# EAGLE design CAPT-B1-01 Cap Touch Matrix Shield (EAGLE 9.4.2)
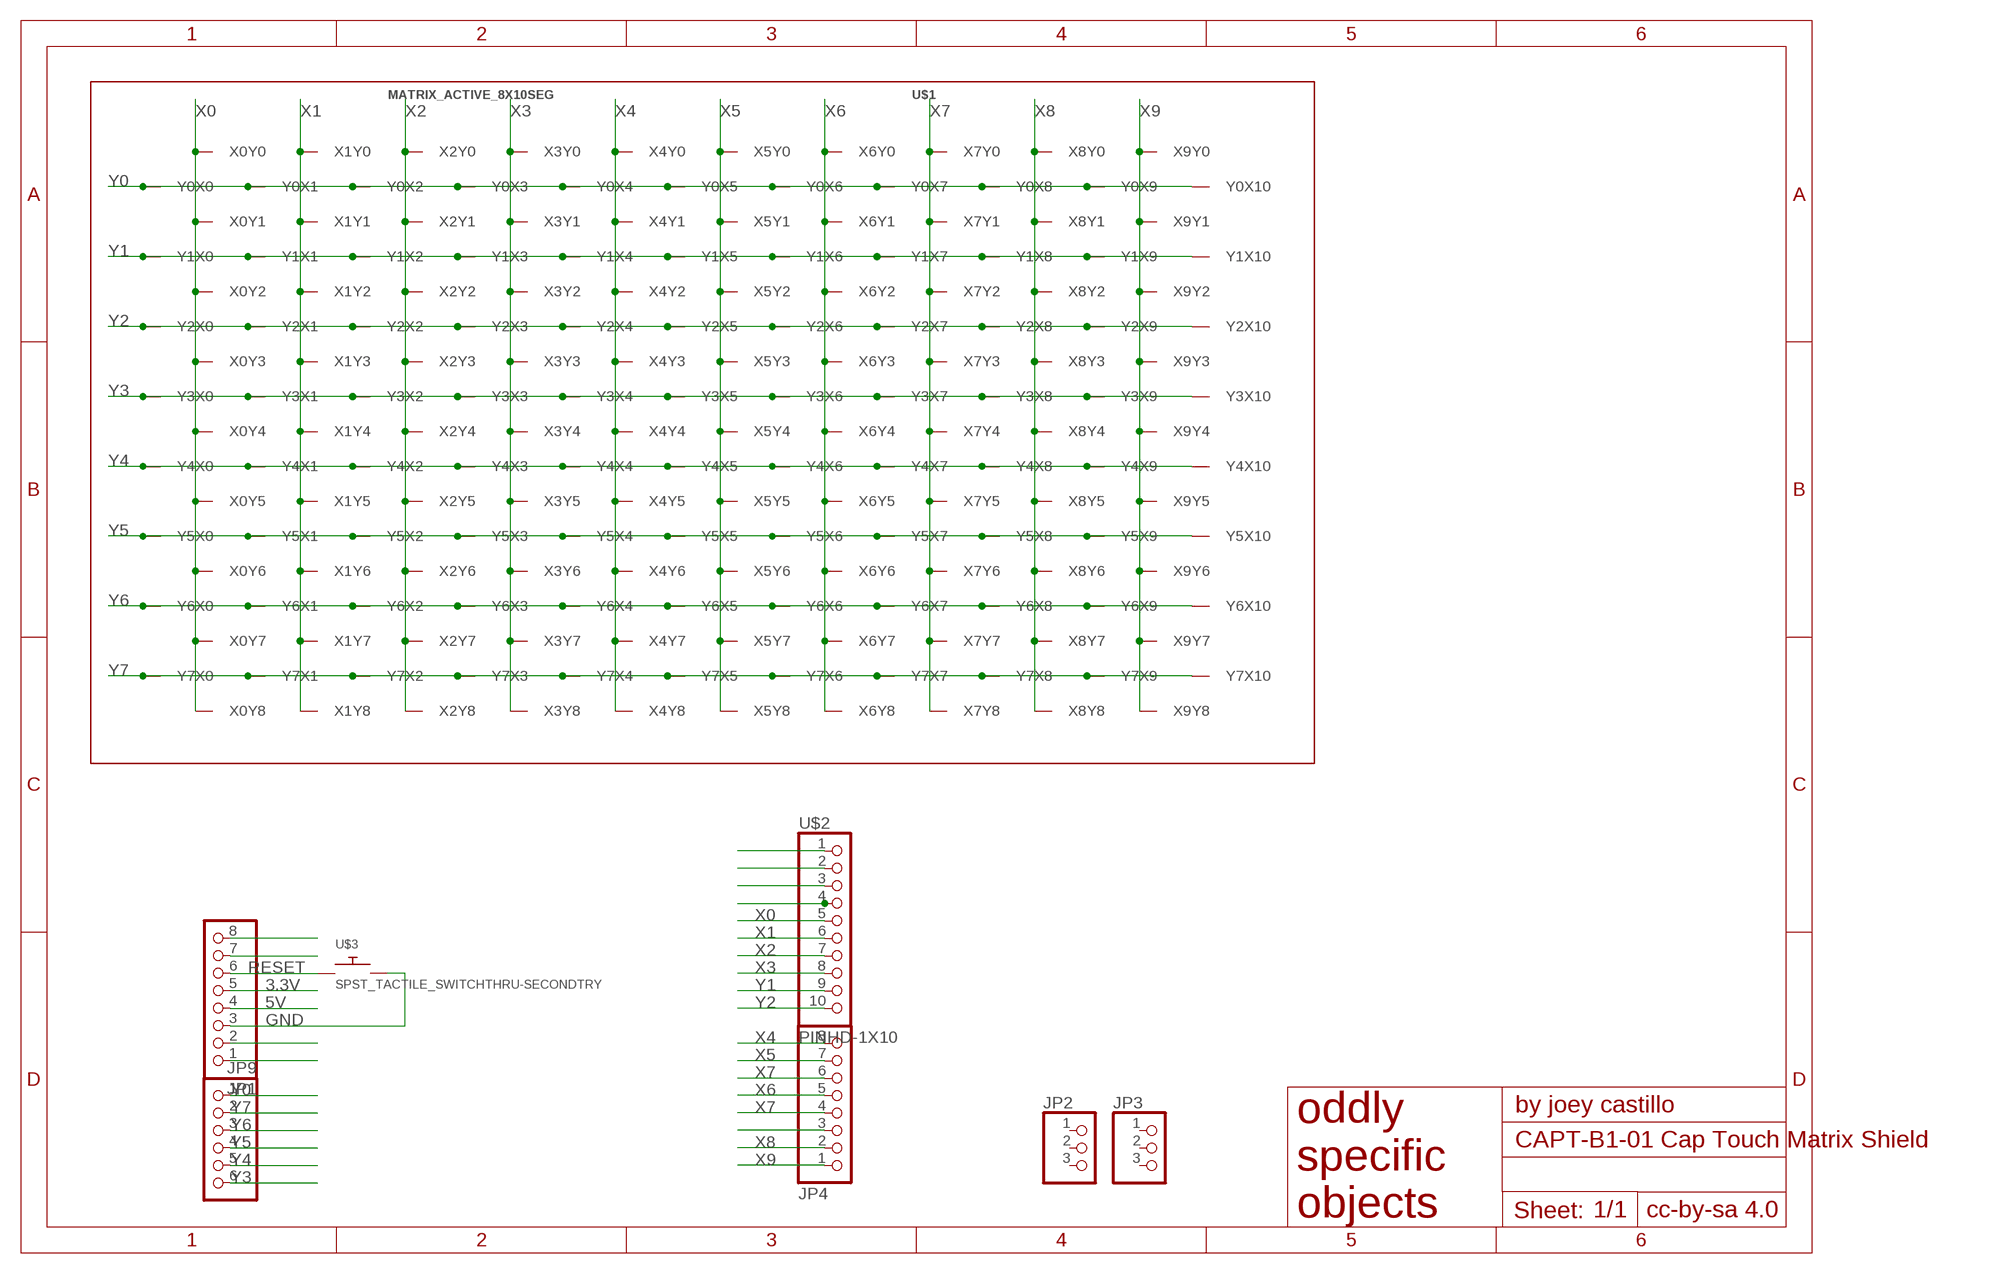
[diagram p0: schematic, sheet 1]

## Parts
JP1  PINHD-1X8CLEANBIG  [1X08-CLEANBIG]
JP2  PINHD-1X3CB  [1X03-CLEANBIG]
JP3  PINHD-1X3CB  [1X03-CLEANBIG]
JP4  PINHD-1X8CLEANBIG  [1X08-CLEANBIG]
JP9  PINHD-1X6CB  [1X06-CLEANBIG]
U$1  MATRIX_ACTIVE_8X10SEG  [MATRIX_ACTIVE_8X10SEG_4MM]
U$2  PINHD-1X10  [1X10-BIG]
U$3  SPST_TACTILE_SWITCHTHRU-SECONDTRY  [MJTP1250-TRY2]

## Nets
3.3V: JP1.5
5V: JP1.4
GND: JP1.3 U$3.P$2
N$1: U$2.4
N$2: U$2.3
N$4: JP1.8
N$6: JP1.2
N$15: JP1.7
N$115: JP4.3
N$153: JP1.1
N$154: U$2.1
N$164: U$2.2
RESET: JP1.6 U$3.P$1
X0: U$1.X0Y0 U$1.X0Y1 U$1.X0Y2 U$1.X0Y3 U$1.X0Y4 U$1.X0Y5 U$1.X0Y6 U$1.X0Y7 U$1.X0Y8 U$2.5
X1: U$1.X1Y0 U$1.X1Y1 U$1.X1Y2 U$1.X1Y3 U$1.X1Y4 U$1.X1Y5 U$1.X1Y6 U$1.X1Y7 U$1.X1Y8 U$2.6
X2: U$1.X2Y0 U$1.X2Y1 U$1.X2Y2 U$1.X2Y3 U$1.X2Y4 U$1.X2Y5 U$1.X2Y6 U$1.X2Y7 U$1.X2Y8 U$2.7
X3: U$1.X3Y0 U$1.X3Y1 U$1.X3Y2 U$1.X3Y3 U$1.X3Y4 U$1.X3Y5 U$1.X3Y6 U$1.X3Y7 U$1.X3Y8 U$2.8
X4: JP4.8 U$1.X4Y0 U$1.X4Y1 U$1.X4Y2 U$1.X4Y3 U$1.X4Y4 U$1.X4Y5 U$1.X4Y6 U$1.X4Y7 U$1.X4Y8
X5: JP4.7 U$1.X5Y0 U$1.X5Y1 U$1.X5Y2 U$1.X5Y3 U$1.X5Y4 U$1.X5Y5 U$1.X5Y6 U$1.X5Y7 U$1.X5Y8
X6: JP4.5 U$1.X6Y0 U$1.X6Y1 U$1.X6Y2 U$1.X6Y3 U$1.X6Y4 U$1.X6Y5 U$1.X6Y6 U$1.X6Y7 U$1.X6Y8
X7: JP4.4 JP4.6 U$1.X7Y0 U$1.X7Y1 U$1.X7Y2 U$1.X7Y3 U$1.X7Y4 U$1.X7Y5 U$1.X7Y6 U$1.X7Y7 U$1.X7Y8
X8: JP4.2 U$1.X8Y0 U$1.X8Y1 U$1.X8Y2 U$1.X8Y3 U$1.X8Y4 U$1.X8Y5 U$1.X8Y6 U$1.X8Y7 U$1.X8Y8
X9: JP4.1 U$1.X9Y0 U$1.X9Y1 U$1.X9Y2 U$1.X9Y3 U$1.X9Y4 U$1.X9Y5 U$1.X9Y6 U$1.X9Y7 U$1.X9Y8
Y0: JP9.1 U$1.Y0X0 U$1.Y0X1 U$1.Y0X2 U$1.Y0X3 U$1.Y0X4 U$1.Y0X5 U$1.Y0X6 U$1.Y0X7 U$1.Y0X8 U$1.Y0X9 U$1.Y0X10
Y1: U$1.Y1X0 U$1.Y1X1 U$1.Y1X2 U$1.Y1X3 U$1.Y1X4 U$1.Y1X5 U$1.Y1X6 U$1.Y1X7 U$1.Y1X8 U$1.Y1X9 U$1.Y1X10 U$2.9
Y2: U$1.Y2X0 U$1.Y2X1 U$1.Y2X2 U$1.Y2X3 U$1.Y2X4 U$1.Y2X5 U$1.Y2X6 U$1.Y2X7 U$1.Y2X8 U$1.Y2X9 U$1.Y2X10 U$2.10
Y3: JP9.6 U$1.Y3X0 U$1.Y3X1 U$1.Y3X2 U$1.Y3X3 U$1.Y3X4 U$1.Y3X5 U$1.Y3X6 U$1.Y3X7 U$1.Y3X8 U$1.Y3X9 U$1.Y3X10
Y4: JP9.5 U$1.Y4X0 U$1.Y4X1 U$1.Y4X2 U$1.Y4X3 U$1.Y4X4 U$1.Y4X5 U$1.Y4X6 U$1.Y4X7 U$1.Y4X8 U$1.Y4X9 U$1.Y4X10
Y5: JP9.4 U$1.Y5X0 U$1.Y5X1 U$1.Y5X2 U$1.Y5X3 U$1.Y5X4 U$1.Y5X5 U$1.Y5X6 U$1.Y5X7 U$1.Y5X8 U$1.Y5X9 U$1.Y5X10
Y6: JP9.3 U$1.Y6X0 U$1.Y6X1 U$1.Y6X2 U$1.Y6X3 U$1.Y6X4 U$1.Y6X5 U$1.Y6X6 U$1.Y6X7 U$1.Y6X8 U$1.Y6X9 U$1.Y6X10
Y7: JP9.2 U$1.Y7X0 U$1.Y7X1 U$1.Y7X2 U$1.Y7X3 U$1.Y7X4 U$1.Y7X5 U$1.Y7X6 U$1.Y7X7 U$1.Y7X8 U$1.Y7X9 U$1.Y7X10
Unconnected: JP2.1 JP2.2 JP2.3 JP3.1 JP3.2 JP3.3

## Library data of the parts
JP1 JP4 = carduino:PINHD-1X8: PIN HEADER
JP2 JP3 = adafruit:PINHD-1X3: PIN HEADER
JP9 = carduino:PINHD-1X6: PIN HEADER
U$1 = My Stuff:MATRIX_ACTIVE_8X10SEG
U$2 = adafruit:PINHD-1X10: Pin header 1x10 0.1" spacing With round pins
U$3 = My Stuff:SPST_TACTILE_SWITCH

## Board
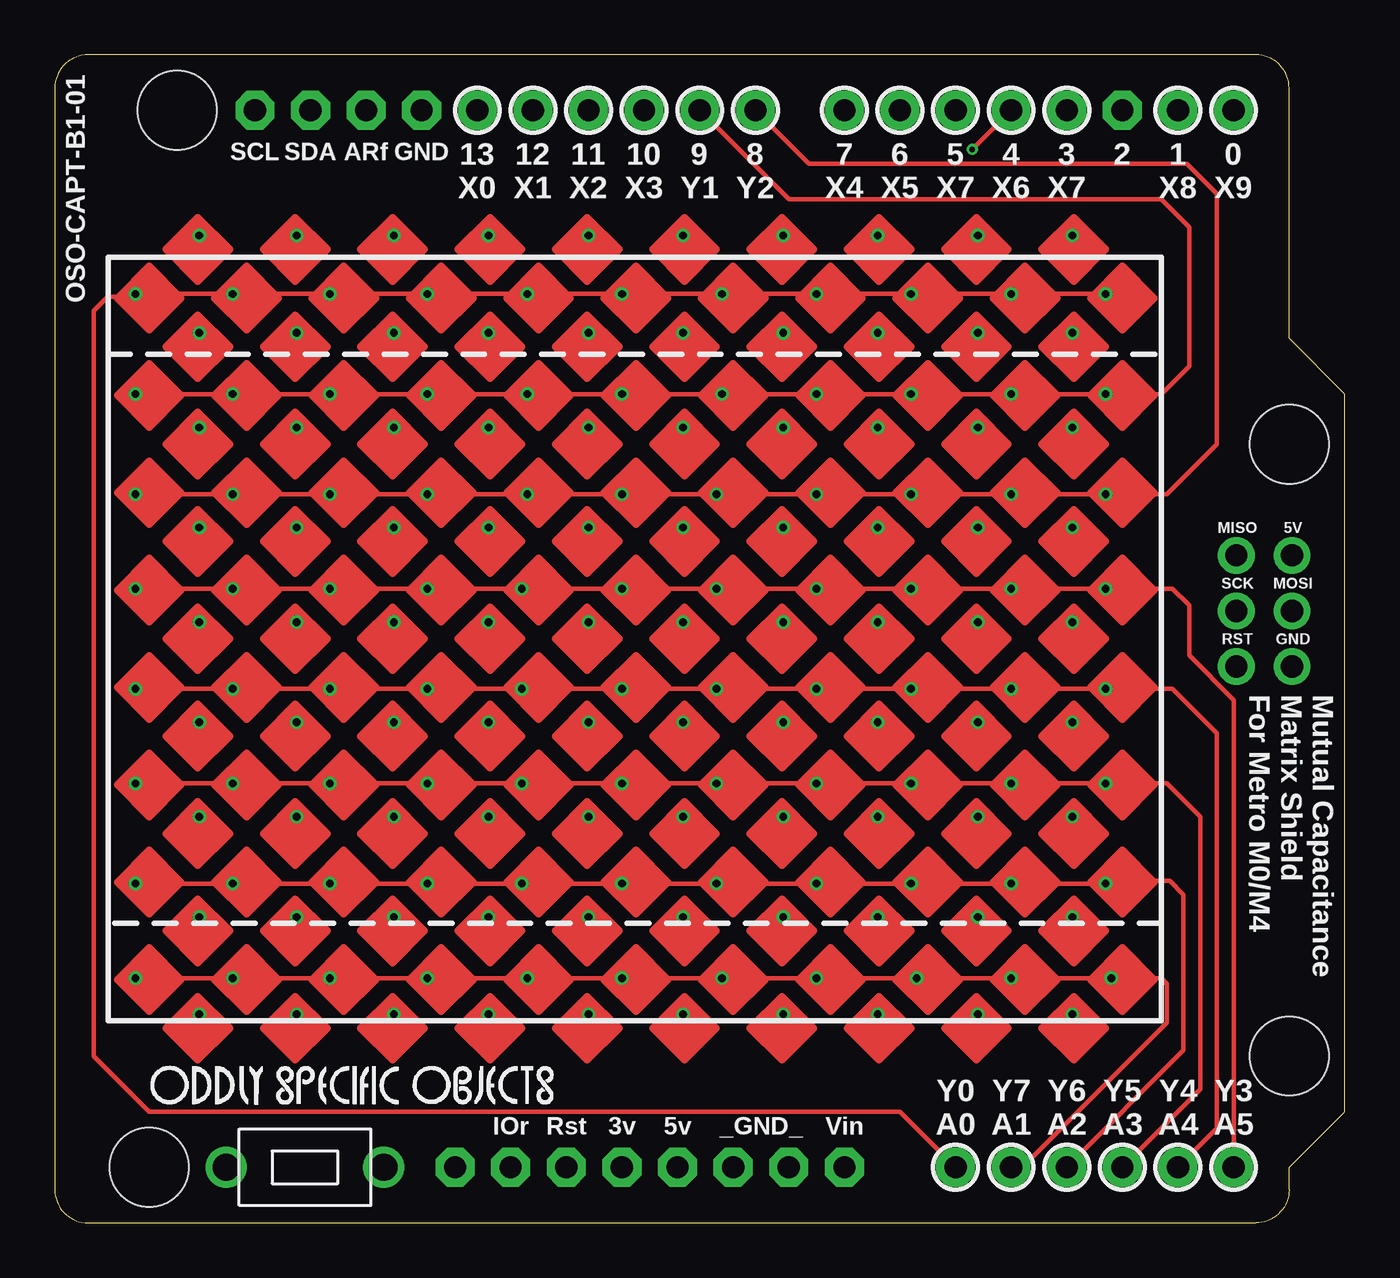
[diagram p1: board, top side]
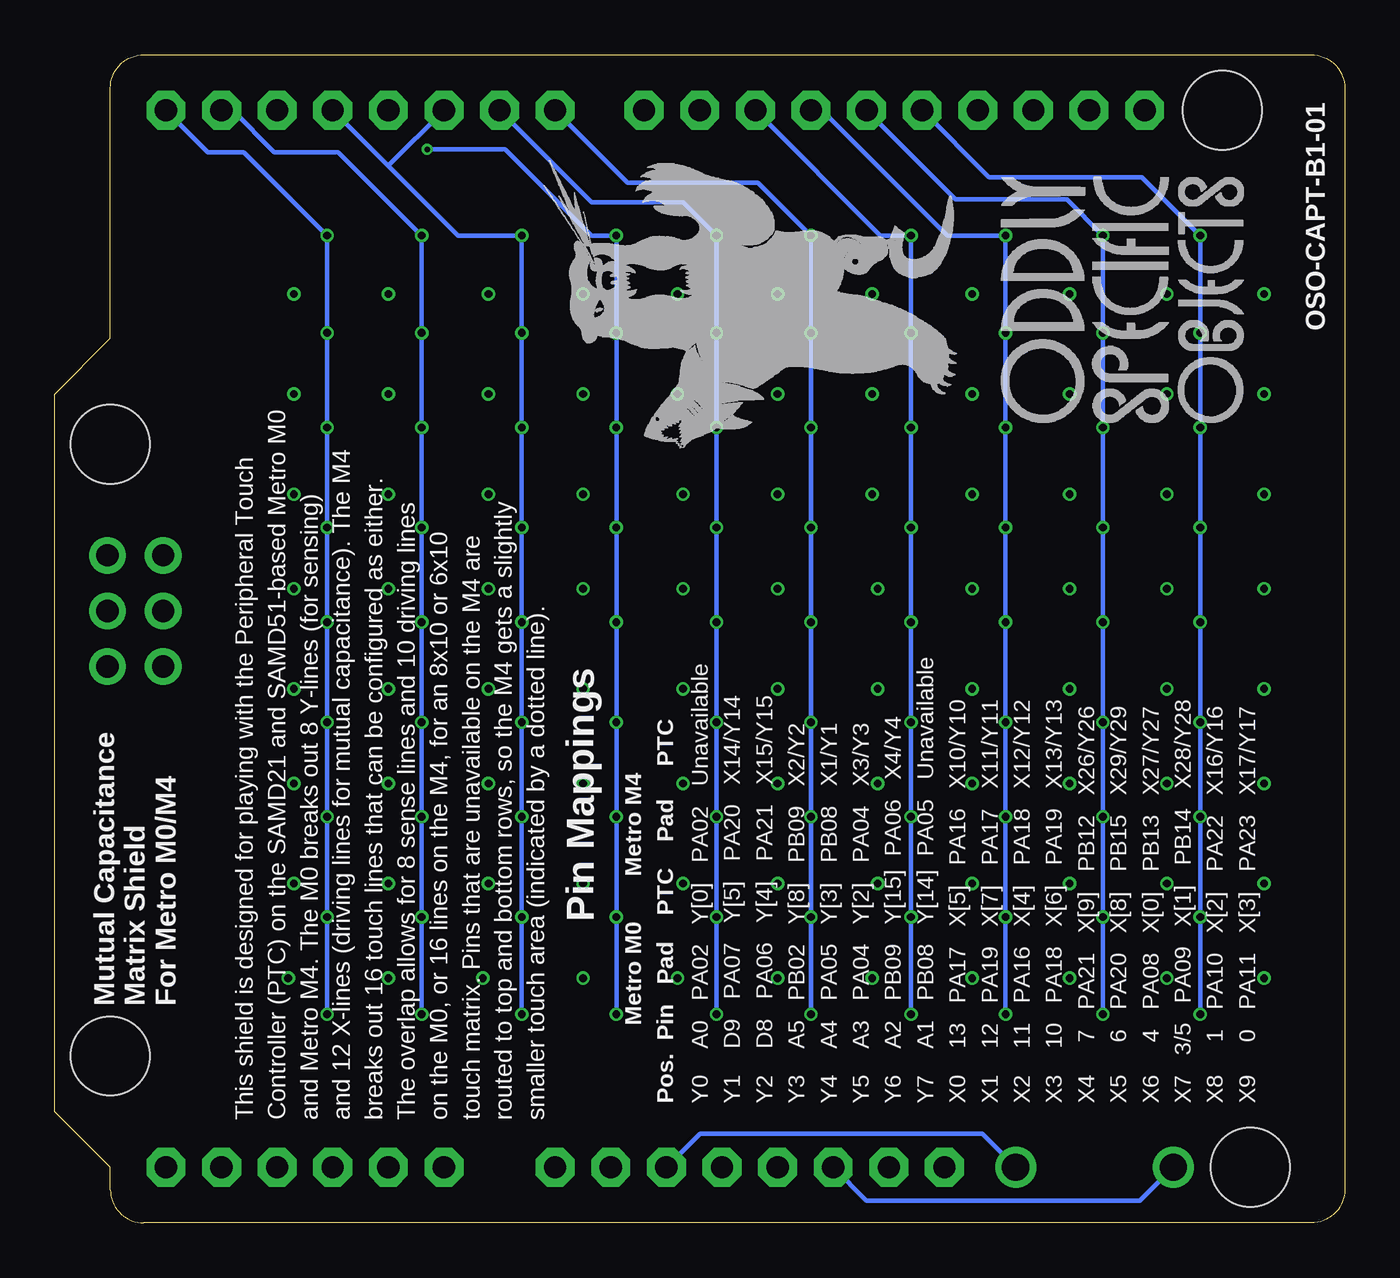
[diagram p2: board, bottom side, seen from below]

Size 58.93 x 53.34 mm. Coordinates in mm from the lower left corner, seen from the top.
Outline: 56.39,1.52 56.39,2.54 58.93,5.08 58.93,37.85 56.39,40.39 56.39,51.82 arc90 54.86,53.34 1.52,53.34 arc90 0,51.82 0,1.52 arc90 1.52,0 54.86,0 arc90 56.39,1.52
Copper layers (1*16): Top 0.035559375mm / dielectric 1.6mm / Bottom 0.035559375mm
Design rules "oshpark-2layer *": minimum track width 6mil, minimum drill 10mil, track to track 6mil, track to pad 6mil, pad to pad 6mil, via to via 6mil, smd to smd 6mil, copper to edge 15mil, drill to drill 6mil, minimum pad ring 5mil, minimum via ring 5mil, stop-mask expansion 2.5mil, vias tented up to drill 10mil, thermal gap 10mil
Holes 3.59 mm at 5.59,50.8 56.39,35.56 4.32,2.54 56.39,7.62

### Footprints (pad centres in the part's own frame; a part is rotated, then mirrored left to right if it is on the bottom)
1X08-CLEANBIG = drill 1.016 pad 1.778 octagon: 1 -8.89,0; 2 -6.35,0; 3 -3.81,0; 4 -1.27,0; 5 1.27,0; 6 3.81,0; 7 6.35,0; 8 8.89,0
1X03-CLEANBIG = drill 1.016 pad 1.676: 1 -2.54,0; 2 0,0; 3 2.54,0
1X06-CLEANBIG = drill 1.016 pad 1.778 octagon: 1 -6.35,0; 2 -3.81,0; 3 -1.27,0; 4 1.27,0; 5 3.81,0; 6 6.35,0
MATRIX_ACTIVE_8X10SEG_4MM = drill 0.356: X0Y0 -24.384,18.415; X0Y1 -24.384,13.97; X0Y2 -24.384,9.652; X0Y3 -24.384,5.08; X0Y4 -24.384,0.762; X0Y5 -24.384,-3.81; X0Y6 -24.384,-8.128; X0Y7 -24.384,-12.7; X0Y8 -24.384,-17.145; X1Y0 -19.939,18.415; X1Y1 -19.939,13.97; X1Y2 -19.939,9.652; X1Y3 -19.939,5.08; X1Y4 -19.939,0.762; X1Y5 -19.939,-3.81; X1Y6 -19.939,-8.128; X1Y7 -19.939,-12.7; X1Y8 -19.939,-17.145; X2Y0 -15.494,18.415; X2Y1 -15.494,13.97; X2Y2 -15.494,9.652; X2Y3 -15.494,5.08; X2Y4 -15.494,0.762; X2Y5 -15.494,-3.81; X2Y6 -15.494,-8.128; X2Y7 -15.494,-12.7; X2Y8 -15.494,-17.145; X3Y0 -11.176,18.415; X3Y1 -11.176,13.97; X3Y2 -11.176,9.652; X3Y3 -11.176,5.08; X3Y4 -11.176,0.762; X3Y5 -11.176,-3.81; X3Y6 -11.176,-8.128; X3Y7 -11.176,-12.7; X3Y8 -11.176,-17.145; X4Y0 -6.604,18.415; X4Y1 -6.604,13.97; X4Y2 -6.604,9.652; X4Y3 -6.604,5.08; X4Y4 -6.604,0.762; X4Y5 -6.604,-3.81; X4Y6 -6.604,-8.128; X4Y7 -6.604,-12.7; X4Y8 -6.604,-17.145; X5Y0 -2.286,18.415; X5Y1 -2.286,13.97; X5Y2 -2.286,9.652; X5Y3 -2.286,5.08; X5Y4 -2.286,0.762; X5Y5 -2.286,-3.81; X5Y6 -2.286,-8.128; X5Y7 -2.286,-12.7; X5Y8 -2.286,-17.145; X6Y0 2.286,18.415; X6Y1 2.286,13.97; X6Y2 2.286,9.652; X6Y3 2.286,5.08; X6Y4 2.286,0.762; X6Y5 2.286,-3.81; X6Y6 2.286,-8.128; X6Y7 2.286,-12.7; X6Y8 2.286,-17.145; X7Y0 6.604,18.415; X7Y1 6.604,13.97; X7Y2 6.604,9.652; X7Y3 6.604,5.08; X7Y4 6.604,0.762; X7Y5 6.604,-3.81; X7Y6 6.604,-8.128; X7Y7 6.604,-12.7; X7Y8 6.604,-17.145; X8Y0 11.176,18.415; X8Y1 11.176,13.97; X8Y2 11.176,9.652; X8Y3 11.176,5.08; X8Y4 11.176,0.762; X8Y5 11.176,-3.81; X8Y6 11.176,-8.128; X8Y7 11.176,-12.7; X8Y8 11.176,-17.145; X9Y0 15.494,18.415; X9Y1 15.494,13.97; X9Y2 15.494,9.652; X9Y3 15.494,5.08; X9Y4 15.494,0.762; X9Y5 15.494,-3.81; X9Y6 15.494,-8.128; X9Y7 15.494,-12.7; X9Y8 15.494,-17.145; Y0X0 -27.305,15.748; Y0X1 -22.86,15.748; Y0X2 -18.415,15.748; Y0X3 -13.97,15.748; Y0X4 -9.398,15.748; Y0X5 -5.08,15.748; Y0X6 -0.508,15.748; Y0X7 3.81,15.748; Y0X8 8.128,15.748; Y0X9 12.7,15.748; Y0X10 17.018,15.748; Y1X0 -27.305,11.176; Y1X1 -22.86,11.176; Y1X2 -18.415,11.176; Y1X3 -13.97,11.176; Y1X4 -9.398,11.176; Y1X5 -5.08,11.176; Y1X6 -0.508,11.176; Y1X7 3.81,11.176; Y1X8 8.128,11.176; Y1X9 12.7,11.176; Y1X10 17.018,11.176; Y2X0 -27.305,6.604; Y2X1 -22.86,6.604; Y2X2 -18.415,6.604; Y2X3 -13.97,6.604; Y2X4 -9.398,6.604; Y2X5 -5.08,6.604; Y2X6 -0.762,6.604; Y2X7 3.81,6.604; Y2X8 8.128,6.604; Y2X9 12.7,6.604; Y2X10 17.018,6.604; Y3X0 -27.305,2.286; Y3X1 -22.86,2.286; Y3X2 -18.415,2.286; Y3X3 -13.97,2.286; Y3X4 -9.652,2.286; Y3X5 -5.08,2.286; Y3X6 -0.762,2.286; Y3X7 3.81,2.286; Y3X8 8.128,2.286; Y3X9 12.7,2.286; Y3X10 17.018,2.286; Y4X0 -27.305,-2.286; Y4X1 -22.86,-2.286; Y4X2 -18.415,-2.286; Y4X3 -13.97,-2.286; Y4X4 -9.652,-2.286; Y4X5 -5.08,-2.286; Y4X6 -0.762,-2.286; Y4X7 3.81,-2.286; Y4X8 8.128,-2.286; Y4X9 12.7,-2.286; Y4X10 17.018,-2.286; Y5X0 -27.305,-6.604; Y5X1 -22.86,-6.604; Y5X2 -18.415,-6.604; Y5X3 -13.97,-6.604; Y5X4 -9.652,-6.604; Y5X5 -5.08,-6.604; Y5X6 -0.762,-6.604; Y5X7 3.81,-6.604; Y5X8 8.128,-6.604; Y5X9 12.7,-6.604; Y5X10 17.018,-6.604; Y6X0 -27.305,-11.176; Y6X1 -22.86,-11.176; Y6X2 -18.415,-11.176; Y6X3 -13.97,-11.176; Y6X4 -9.652,-11.176; Y6X5 -5.08,-11.176; Y6X6 -0.762,-11.176; Y6X7 3.81,-11.176; Y6X8 8.128,-11.176; Y6X9 12.7,-11.176; Y6X10 17.018,-11.176; Y7X0 -27.305,-15.494; Y7X1 -22.86,-15.494; Y7X2 -18.415,-15.494; Y7X3 -13.97,-15.494; Y7X4 -9.398,-15.494; Y7X5 -5.08,-15.494; Y7X6 -0.508,-15.494; Y7X7 3.81,-15.494; Y7X8 8.382,-15.494; Y7X9 12.7,-15.494; Y7X10 17.272,-15.494
1X10-BIG = drill 1.016 pad 1.778 octagon: 1 -11.43,0; 2 -8.89,0; 3 -6.35,0; 4 -3.81,0; 5 -1.27,0; 6 1.27,0; 7 3.81,0; 8 6.35,0; 9 8.89,0; 10 11.43,0
MJTP1250-TRY2 = drill 1.25: P$1 -3.6,0; P$2 3.6,0

### Placement (x,y rotation side)
JP1  27.18,2.54 180 top
JP2  53.98,27.94 90 top
JP3  56.52,27.94 90 top
JP4  44.96,50.8 180 top
JP9  47.5,2.54 0 top
U$1  30.99,26.67 0 top
U$2  20.57,50.8 0 top
U$3  11.43,2.54 0 top
U$4  [OSO_BEAR_525X750MIL_1000DPI]  27.18,41.91 90 bottom
U$5  [OSO_WORDMARK_ONELINE_725MIL_1000DPI]  4.32,5.33 0 top
U$6  [OSO_WORDMARK_THREELINE_450MIL_1000DPI]  10.16,42.16 90 bottom

### Tracks (layer width: path | path; a pad name or v marks a point on that pad's centre or on a via)
GND
  Bottom 0.203: U$3.P$2 16.55,4.06 29.46,4.06 JP1.3
RESET
  Bottom 0.203: U$3.P$1 9.35,1.02 21.84,1.02 JP1.6
X0
  Bottom 0.203: U$2.5 16.26,47.75 9.27,47.75 U$1.X0Y0 U$1.X0Y1 U$1.X0Y2 U$1.X0Y3 U$1.X0Y4 U$1.X0Y5 U$1.X0Y6 U$1.X0Y7 U$1.X0Y8
X1
  Bottom 0.203: U$2.6 17.78,46.74 12.7,46.74 U$1.X1Y0 U$1.X1Y1 U$1.X1Y2 U$1.X1Y3 U$1.X1Y4 U$1.X1Y5 U$1.X1Y6 U$1.X1Y7 U$1.X1Y8
X2
  Bottom 0.203: U$2.7 23.88,50.8 18.16,45.09 U$1.X2Y0 U$1.X2Y1 U$1.X2Y2 U$1.X2Y3 U$1.X2Y4 U$1.X2Y5 U$1.X2Y6 U$1.X2Y7 U$1.X2Y8
X3
  Bottom 0.203: U$2.8 21.21,45.09 U$1.X3Y0 U$1.X3Y1 U$1.X3Y2 U$1.X3Y3 U$1.X3Y4 U$1.X3Y5 U$1.X3Y6 U$1.X3Y7 U$1.X3Y8
X4
  Bottom 0.203: JP4.8 32.77,47.5 26.8,47.5 U$1.X4Y0 U$1.X4Y1 U$1.X4Y2 U$1.X4Y3 U$1.X4Y4 U$1.X4Y5 U$1.X4Y6 U$1.X4Y7 U$1.X4Y8
X5
  Bottom 0.203: JP4.7 34.42,46.61 30.23,46.61 U$1.X5Y0 U$1.X5Y1 U$1.X5Y2 U$1.X5Y3 U$1.X5Y4 U$1.X5Y5 U$1.X5Y6 U$1.X5Y7 U$1.X5Y8
X6  (via drill 0.25)
  Top 0.203: JP4.5 v41.91,49.02
  Bottom 0.203: v41.91,49.02 38.35,49.02 34.42,45.09 33.53,45.09 | 33.53,45.09 U$1.X6Y0 | U$1.X6Y8 U$1.X6Y7 U$1.X6Y6 U$1.X6Y5 U$1.X6Y4 U$1.X6Y3 U$1.X6Y2 U$1.X6Y1 33.27,44.83 33.53,45.09
X7
  Bottom 0.203: JP4.4 43.69,48.26 | 43.69,48.26 40.51,45.09 U$1.X7Y0 U$1.X7Y1 U$1.X7Y2 U$1.X7Y3 U$1.X7Y4 U$1.X7Y5 U$1.X7Y6 U$1.X7Y7 U$1.X7Y8 | JP4.6 43.69,48.26
X8
  Bottom 0.203: JP4.2 50.8,50.8 48.89,48.9 45.97,48.9 U$1.X8Y0 U$1.X8Y1 U$1.X8Y2 U$1.X8Y3 U$1.X8Y4 U$1.X8Y5 U$1.X8Y6 U$1.X8Y7 U$1.X8Y8
X9
  Bottom 0.203: JP4.1 51.94,48.9 50.29,48.9 U$1.X9Y0 U$1.X9Y1 U$1.X9Y2 U$1.X9Y3 U$1.X9Y4 U$1.X9Y5 U$1.X9Y6 U$1.X9Y7 U$1.X9Y8
Y0
  Top 0.203: JP9.1 38.61,5.08 4.32,5.08 1.78,7.62 1.78,41.66 2.41,42.29 3.56,42.29 U$1.Y0X0 U$1.Y0X1 U$1.Y0X2 U$1.Y0X3 U$1.Y0X4 U$1.Y0X5 U$1.Y0X6 U$1.Y0X7 U$1.Y0X8 U$1.Y0X9 U$1.Y0X10
Y1
  Top 0.203: U$2.9 33.53,46.74 50.55,46.74 51.82,45.47 51.82,39.12 50.55,37.85 U$1.Y1X10 U$1.Y1X9 U$1.Y1X8 U$1.Y1X7 U$1.Y1X6 U$1.Y1X5 U$1.Y1X4 U$1.Y1X3 U$1.Y1X2 U$1.Y1X1 U$1.Y1X0
Y2
  Top 0.203: U$2.10 34.44,48.36 51.71,48.36 53.09,46.98 53.09,35.56 50.8,33.27 U$1.Y2X10 U$1.Y2X9 U$1.Y2X8 U$1.Y2X7 U$1.Y2X6 U$1.Y2X5 U$1.Y2X4 U$1.Y2X3 U$1.Y2X2 U$1.Y2X1 U$1.Y2X0
Y3
  Top 0.203: JP9.6 53.85,23.88 51.82,25.91 51.82,28.19 51.05,28.96 U$1.Y3X10 U$1.Y3X9 U$1.Y3X8 U$1.Y3X7 U$1.Y3X6 U$1.Y3X5 U$1.Y3X4 U$1.Y3X3 U$1.Y3X2 U$1.Y3X1 U$1.Y3X0
Y4
  Top 0.203: JP9.5 53.09,4.32 53.09,22.35 51.05,24.38 U$1.Y4X10 U$1.Y4X9 U$1.Y4X8 U$1.Y4X7 U$1.Y4X6 U$1.Y4X5 U$1.Y4X4 U$1.Y4X3 U$1.Y4X2 U$1.Y4X1 U$1.Y4X0
Y5
  Top 0.203: JP9.4 52.32,6.1 52.32,18.54 50.8,20.07 U$1.Y5X10 U$1.Y5X9 U$1.Y5X8 U$1.Y5X7 U$1.Y5X6 U$1.Y5X5 U$1.Y5X4 U$1.Y5X3 U$1.Y5X2 U$1.Y5X1 U$1.Y5X0
Y6
  Top 0.203: JP9.3 51.56,7.87 51.56,14.99 50.93,15.62 48.39,15.62 48.26,15.49 U$1.Y6X10 U$1.Y6X9 U$1.Y6X8 U$1.Y6X7 U$1.Y6X6 U$1.Y6X5 U$1.Y6X4 U$1.Y6X3 U$1.Y6X2 U$1.Y6X1 U$1.Y6X0
Y7
  Top 0.203: JP9.2 44.2,2.54 50.8,9.14 50.8,10.92 50.55,11.18 U$1.Y7X10 U$1.Y7X9 U$1.Y7X8 U$1.Y7X7 U$1.Y7X6 U$1.Y7X5 U$1.Y7X4 U$1.Y7X3 U$1.Y7X2 U$1.Y7X1 U$1.Y7X0

### Text on the board
tPlace: OSO-CAPT-B1-01 | SCL | SDA | ARf | GND | 13 / X0 | 12 / X1 | 11 / X2 | 10 / X3 | 9 / Y1 | 8 / Y2 | 7 / X4 | 6 / X5 | 5 / X7 | 4 / X6 | 3 / X7 | 2 | 1 / X8 | 0 / X9 | MISO | 5V | SCK | MOSI | RST | GND | Mutual Capacitance / Matrix Shield / For Metro M0/M4 | IOr | Rst | 3v | 5v | _GND_ | Vin | Y0 / A0 | Y7 / A1 | Y6 / A2 | Y5 / A3 | Y4 / A4 | Y3 / A5
bPlace: OSO-CAPT-B1-01 | Pin Mappings | Mutual Capacitance / Matrix Shield / For Metro M0/M4 | Y0 A0 PA02 Y[0] PA02 Unavailable / Y1 D9 PA07 Y[5] PA20 X14/Y14 / Y2 D8 PA06 Y[4] PA21 X15/Y15 / Y3 A5 PB02 Y[8] PB09 X2/Y2 / Y4 A4 PA05 Y[3] PB08 X1/Y1 / Y5 A3 PA04 Y[2] PA04 X3/Y3 / Y6 A2 PB09 Y[15] PA06 X4/Y4 / Y7 A1 PB08 Y[14] PA05 Unavailable / X0 13 PA17 X[5] PA16 X10/Y10 / X1 12 PA19 X[7] PA17 X11/Y11 / X2 11 PA16 X[4] PA18 X12/Y12 / X3 10 PA18 X[6] PA19 X13/Y13 / X4 7 PA21 X[9] PB12 X26/Y26 / X5 6 PA20 X[8] PB15 X29/Y29 / X6 4 PA08 X[0] PB13 X27/Y27 / X7 3/5 PA09 X[1] PB14 X28/Y28 / X8 1 PA10 X[2] PA22 X16/Y16 / X9 0 PA11 X[3] PA23 X17/Y17 | Metro M0 Metro M4 / Pos. Pin Pad PTC Pad PTC | This shield is designed for playing with the Peripheral Touch / Controller (PTC) on the SAMD21 and SAMD51-based Metro M0 / and Metro M4. The M0 breaks out 8 Y-lines (for sensing) / and 12 X-lines (driving lines for mutual capacitance). The M4 / breaks out 16 touch lines that can be configured as either. / The overlap allows for 8 sense lines and 10 driving lines / on the M0, or 16 lines on the M4, for an 8x10 or 6x10 / touch matrix. Pins that are unavailable on the M4 are / routed to top and bottom rows, so the M4 gets a slightly / smaller touch area (indicated by a dotted line).